# EAGLE design Logic Module - Power V7.2 (EAGLE 9.3.1)
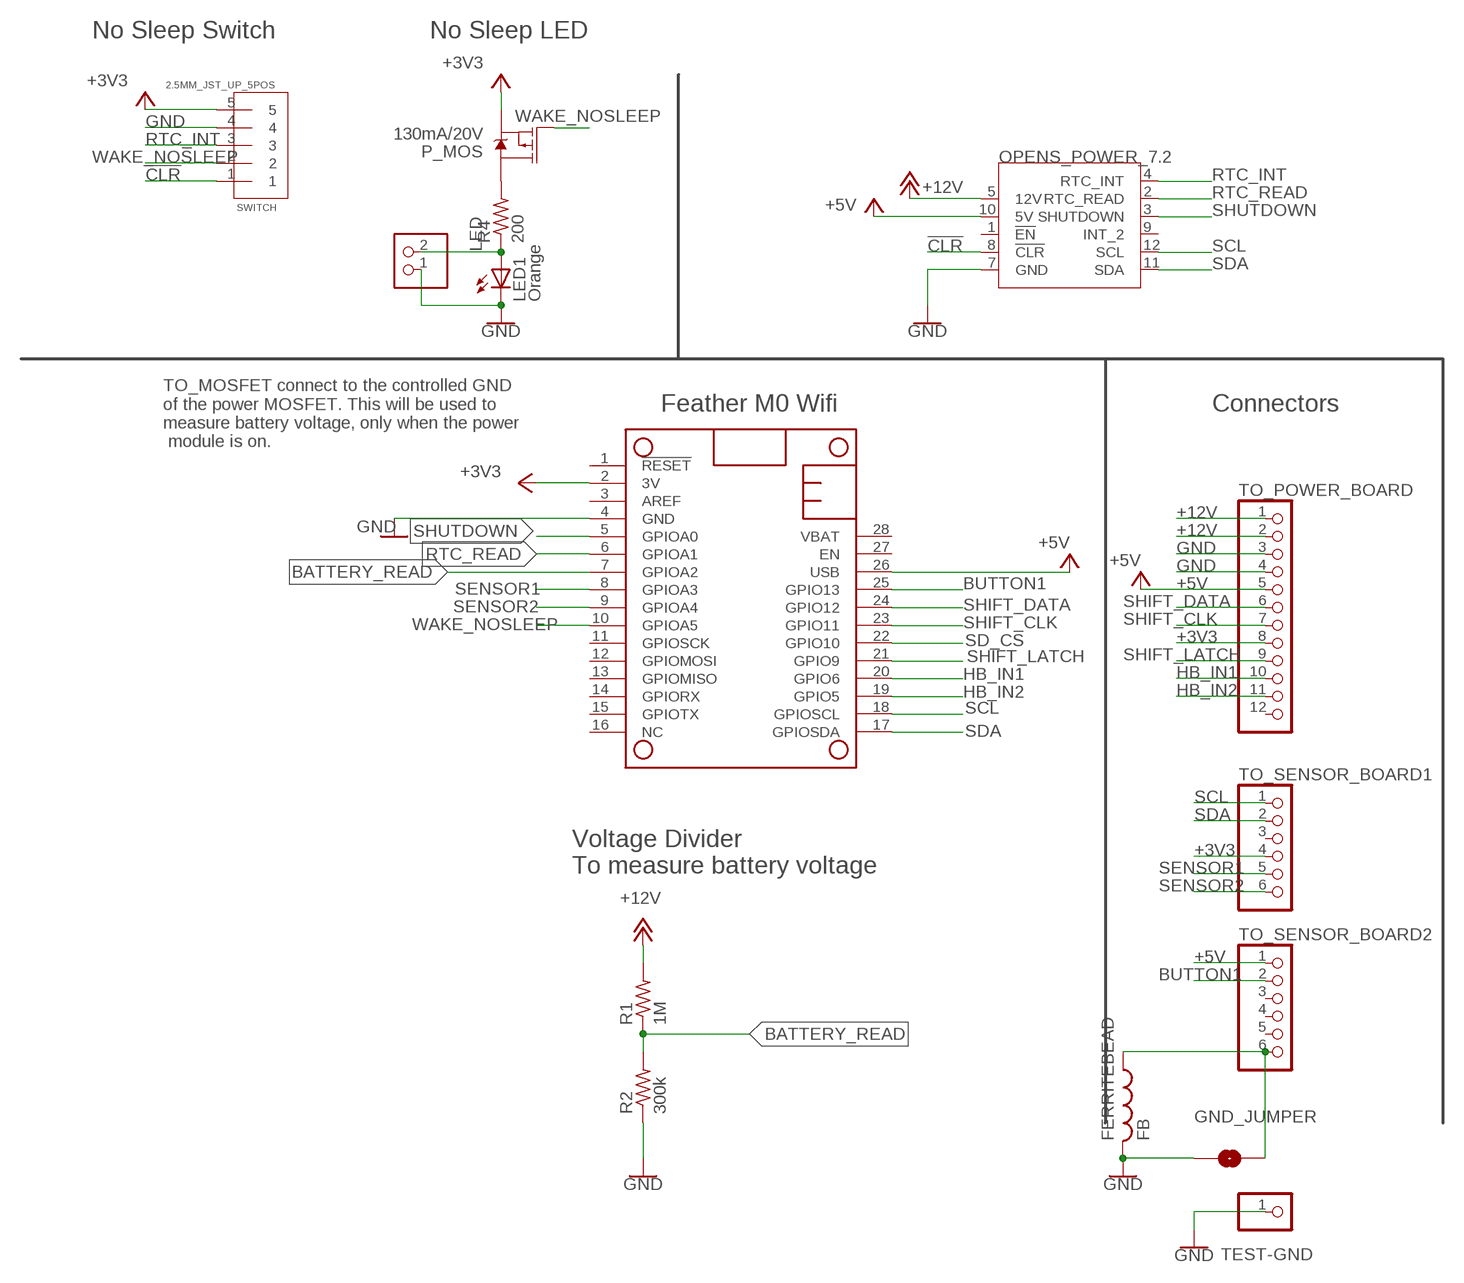
[diagram p0: schematic, sheet 1]

## Parts
FERRITEBEAD  FB  [FB]
GND_JUMPER  JUMPER-SMT_2_NO_NO-SILK  [SMT-JUMPER_2_NO_NO-SILK]
LED  2.5MM_JST_UP_2POS  [JST_2POS_2.5MM_UP]
LED1  Orange  LED3MM  [LED3MM]
MS1  FEATHERWING  [FEATHERWING]
P_MOS  130mA/20V  MOSFET_PCH-IRLML2244  [SOT23-3]
R1  1M  R-US_R1206  [R1206]
R2  300k  R-US_R1206  [R1206]
R4  200  R-US_0204/7  [0204/7]
SWITCH  2.5MM_JST_UP_5POS  [JST_5POS_2.5MM_UP]
TEST-GND  PINHD-1X1  [1X01]
TO_POWER_BOARD  PINHD-1X12  [1X12]
TO_SENSOR_BOARD1  PINHD-1X6CB  [1X06-CLEANBIG]
TO_SENSOR_BOARD2  PINHD-1X6CB  [1X06-CLEANBIG]
U$1  OPENS_POWER_7.2  [OPENS_POWER_7.2]

## Nets
!CLR: SWITCH.1 U$1.8(!CLR)
+3V3: MS1.2(3V) P_MOS.2(S) SWITCH.5 TO_POWER_BOARD.8 TO_SENSOR_BOARD1.4
+5V [12v]: MS1.26(USB) TO_POWER_BOARD.5 TO_SENSOR_BOARD2.1 U$1.10(5V)
+12V [12v]: R1.2 TO_POWER_BOARD.1 TO_POWER_BOARD.2 U$1.5(12V)
BATTERY_READ: MS1.7(GPIOA2) R1.1 R2.2
BUTTON1: MS1.25(GPIO13) TO_SENSOR_BOARD2.2
GND: FERRITEBEAD.P$2 GND_JUMPER.1 LED1.K(C) LED.1 MS1.4(GND) R2.1 SWITCH.4 TEST-GND.1 TO_POWER_BOARD.3 TO_POWER_BOARD.4 U$1.7(GND)
HB_IN1: MS1.20(GPIO6) TO_POWER_BOARD.10
HB_IN2: MS1.19(GPIO5) TO_POWER_BOARD.11
N$2: P_MOS.3(D) R4.2
N$3: LED1.A LED.2 R4.1
N$6: FERRITEBEAD.P$1 GND_JUMPER.2 TO_SENSOR_BOARD2.6
RTC_INT: SWITCH.3 U$1.4(RTC_INT)
RTC_READ: MS1.6(GPIOA1) U$1.2(RTC_READ)
SCL: MS1.18(GPIOSCL) TO_SENSOR_BOARD1.1 U$1.12(SCL)
SD_CS: MS1.22(GPIO10)
SDA: MS1.17(GPIOSDA) TO_SENSOR_BOARD1.2 U$1.11(SDA)
SENSOR1: MS1.8(GPIOA3) TO_SENSOR_BOARD1.5
SENSOR2: MS1.9(GPIOA4) TO_SENSOR_BOARD1.6
SHIFT_CLK: MS1.23(GPIO11) TO_POWER_BOARD.7
SHIFT_DATA: MS1.24(GPIO12) TO_POWER_BOARD.6
SHIFT_LATCH: MS1.21(GPIO9) TO_POWER_BOARD.9
SHUTDOWN: MS1.5(GPIOA0) U$1.3(SHUTDOWN)
WAKE_NOSLEEP: MS1.10(GPIOA5) P_MOS.1(G) SWITCH.2
Unconnected: MS1.1(!RESET) MS1.3(AREF) MS1.11(GPIOSCK) MS1.12(GPIOMOSI) MS1.13(GPIOMISO) MS1.14(GPIORX) MS1.15(GPIOTX) MS1.16(NC) MS1.27(EN) MS1.28(VBAT) TO_POWER_BOARD.12 TO_SENSOR_BOARD1.3 TO_SENSOR_BOARD2.3 TO_SENSOR_BOARD2.4 TO_SENSOR_BOARD2.5 U$1.1(!EN) U$1.9(INT_2)

## Notes on the sheet
- No Sleep Switch | No Sleep LED
- Feather M0 Wifi | Connectors
- TO_MOSFET connect to the controlled GND 
  of the power MOSFET. This will be used to
  measure battery voltage, only when the power
   module is on.
- Voltage Divider
  To measure battery voltage

## Library data of the parts
FERRITEBEAD = adafruit:FB: Ferrite bead Digikey #P9821BK-ND
GND_JUMPER = SparkFun-Jumpers:JUMPER-SMT_2_NO: Normally open jumper This jumper has two pads in close proximity to each other. Apply solder to close the connection. Round pads are easier to solder for beginners, but are a lot larger. SparkFun Product that uses the round pads: SparkFun EL Sequencer <https://www.sparkfun.com/products/12781>
LED = eDNA:2.5MM_JST_UP_2POS
LED1 = adafruit:LED: LED OSRAM: - CHIPLED LG R971, LG N971, LY N971, LG Q971, LY Q971, LO R971, LY R971 LH N974, LH R974 LS Q976, LO Q976, LY Q976 LO Q996 - Hyper CHIPLED LW Q18S LB Q993, LB Q99A, LB R99A - SideLED LS A670, LO A670, LY A670, LG A670, LP A670 LB A673, LV A673, LT A673, LW A673 LH A674 LY A675 LS A676, LA A676, LO A676, LY A676, LW A676 LS A679, LY A679, LG A679 - Hyper Micro SIDELED® LS Y876, LA Y876, LO Y876, LY Y876 LT Y87S - SmartLED LW L88C, LW L88S LB L89C, LB L89S, LG L890 LS L89K, LO L89K, LY L89K LS L896, LA L896, LO L896, LY L896 - TOPLED LS T670, LO T670, LY T670, LG T670, LP T670 LSG T670, LSP T670, LSY T670, LOP T670, LYG T670 LG T671, LOG T671, LSG T671 LB T673, LV T673, LT T673, LW T673 LH T674 LS T676, LA T676, LO T676, LY T676, LB T676, LH T676, LSB T676, LW T676 LB T67C, LV T67C, LT T67C, LS T67K, LO T67K, LY T67K, LW E67C LS E67B, LA E67B, LO E67B, LY E67B, LB E67C, LV E67C, LT E67C LW T67C LS T679, LY T679, LG T679 LS T770, LO T770, LY T770, LG T770, LP T770 LB T773, LV T773, LT T773, LW T773 LH T774 LS E675, LA E675, LY E675, LS T675 LS T776, LA T776, LO T776, LY T776, LB T776 LHGB T686 LT T68C, LB T68C - Hyper Mini TOPLED® LB M676 - Mini TOPLED Santana® LG M470 LS M47K, LO M47K, LY M47K Source: http://www.osram.convergy.de/
MS1 = adafruit:FEATHERWING
P_MOS = SparkFun-DiscreteSemi:MOSFET_PCH: P-channel MOSFETs Voltage controlled devices that allow control of high current outputs. SparkFun Products: SparkFun ESP32 Thing <https://www.sparkfun.com/products/13907> SparkFun ESP8266 Thing <https://www.sparkfun.com/products/13231>; PROD_ID: TRANS-11153; VALUE: 4.3A/20V/54mΩ
R1 R2 R4 = adafruit:R-US_: RESISTOR, American symbol
SWITCH = eDNA:2.5MM_JST_UP_5POS: 2.5MM JST 5POS, 5 Position, up https://www.digikey.com/product-detail/en/jst-sales-america-inc/B5B-XH-A-LF-SN/455-2270-ND/1530483
TEST-GND = adafruit:PINHD-1X1: Pin header 1x1 for 0.1" spacing With round pins
TO_POWER_BOARD = adafruit:PINHD-1X12: PIN HEADER
TO_SENSOR_BOARD1 TO_SENSOR_BOARD2 = adafruit:PINHD-1X6: PIN HEADER
U$1 = eDNA:OPENS_POWER_7.2: OPENSLAB power board version 7.2 Designed by Mitch and upgrade/update by Bao Nguyen

## Net classes
0 default: clearance 0.2 mm
1 12v: width 0.61 mm, clearance 0.356 mm
2 5v: width 0.406 mm, clearance 0.305 mm
3 sig: width 0.152 mm, clearance 0.152 mm

## Board
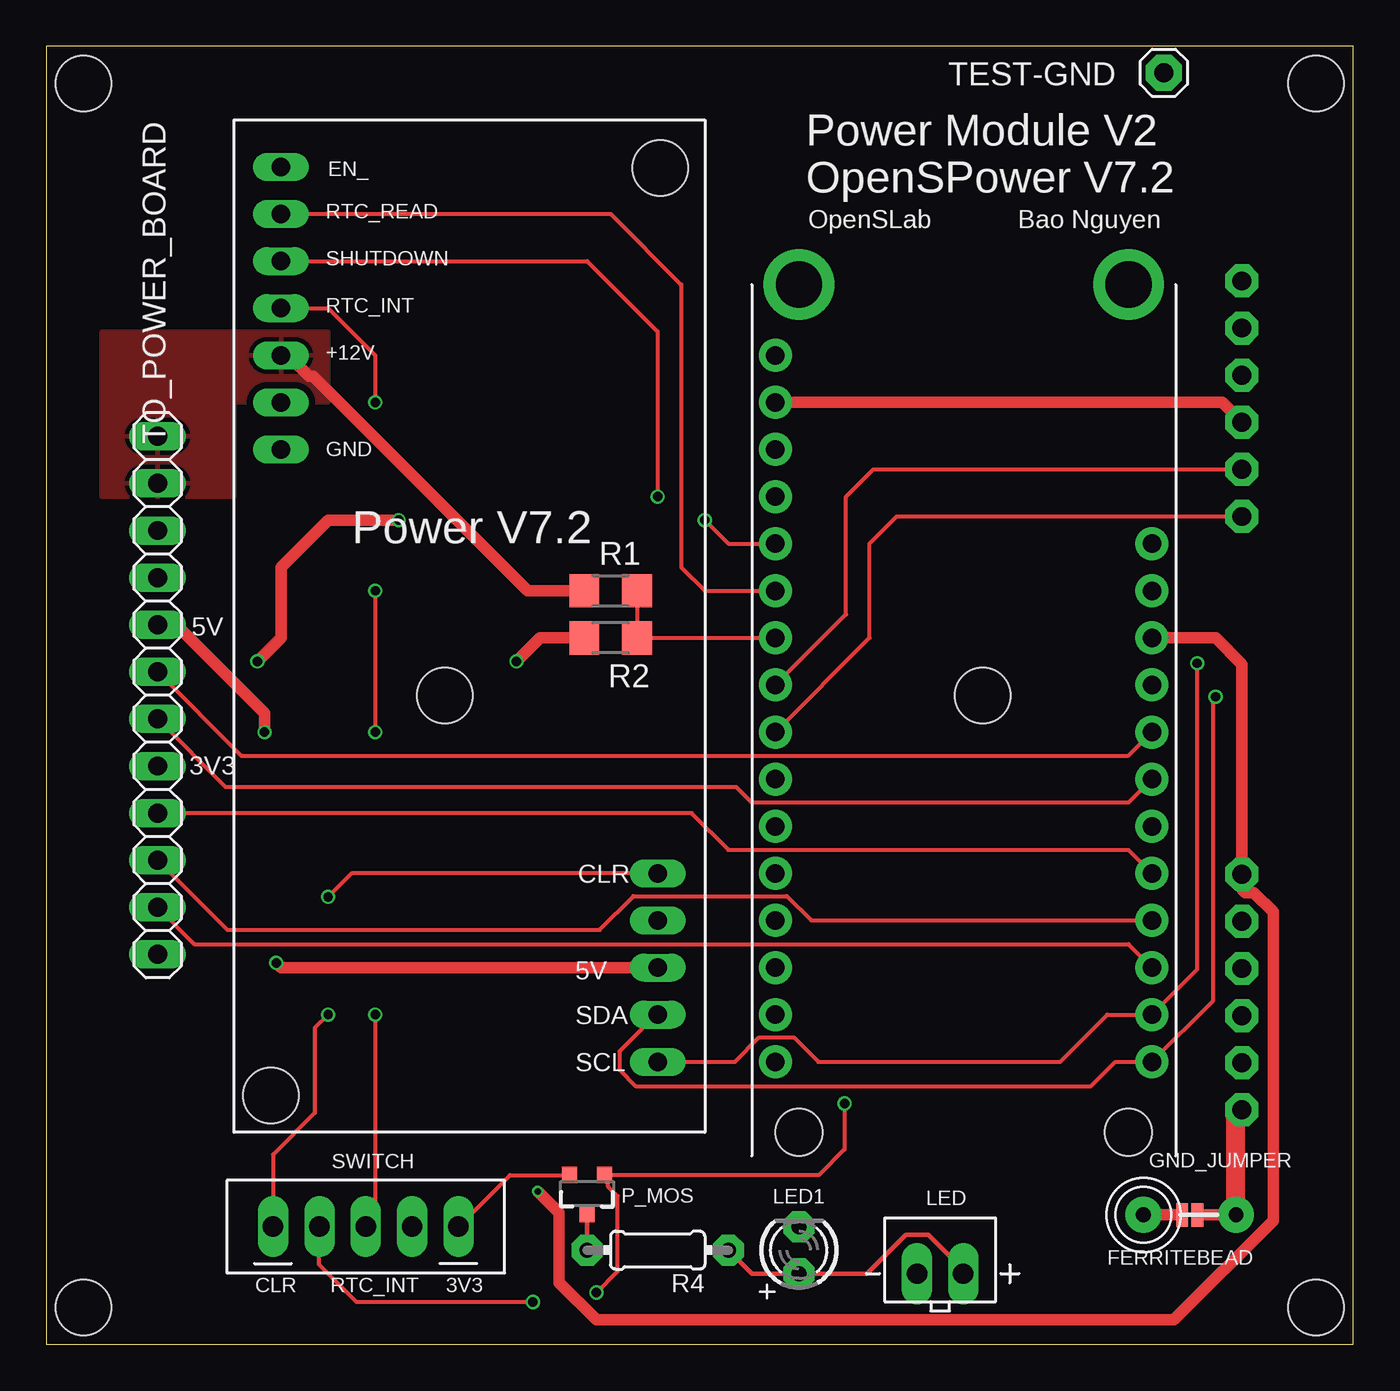
[diagram p1: board, top side]
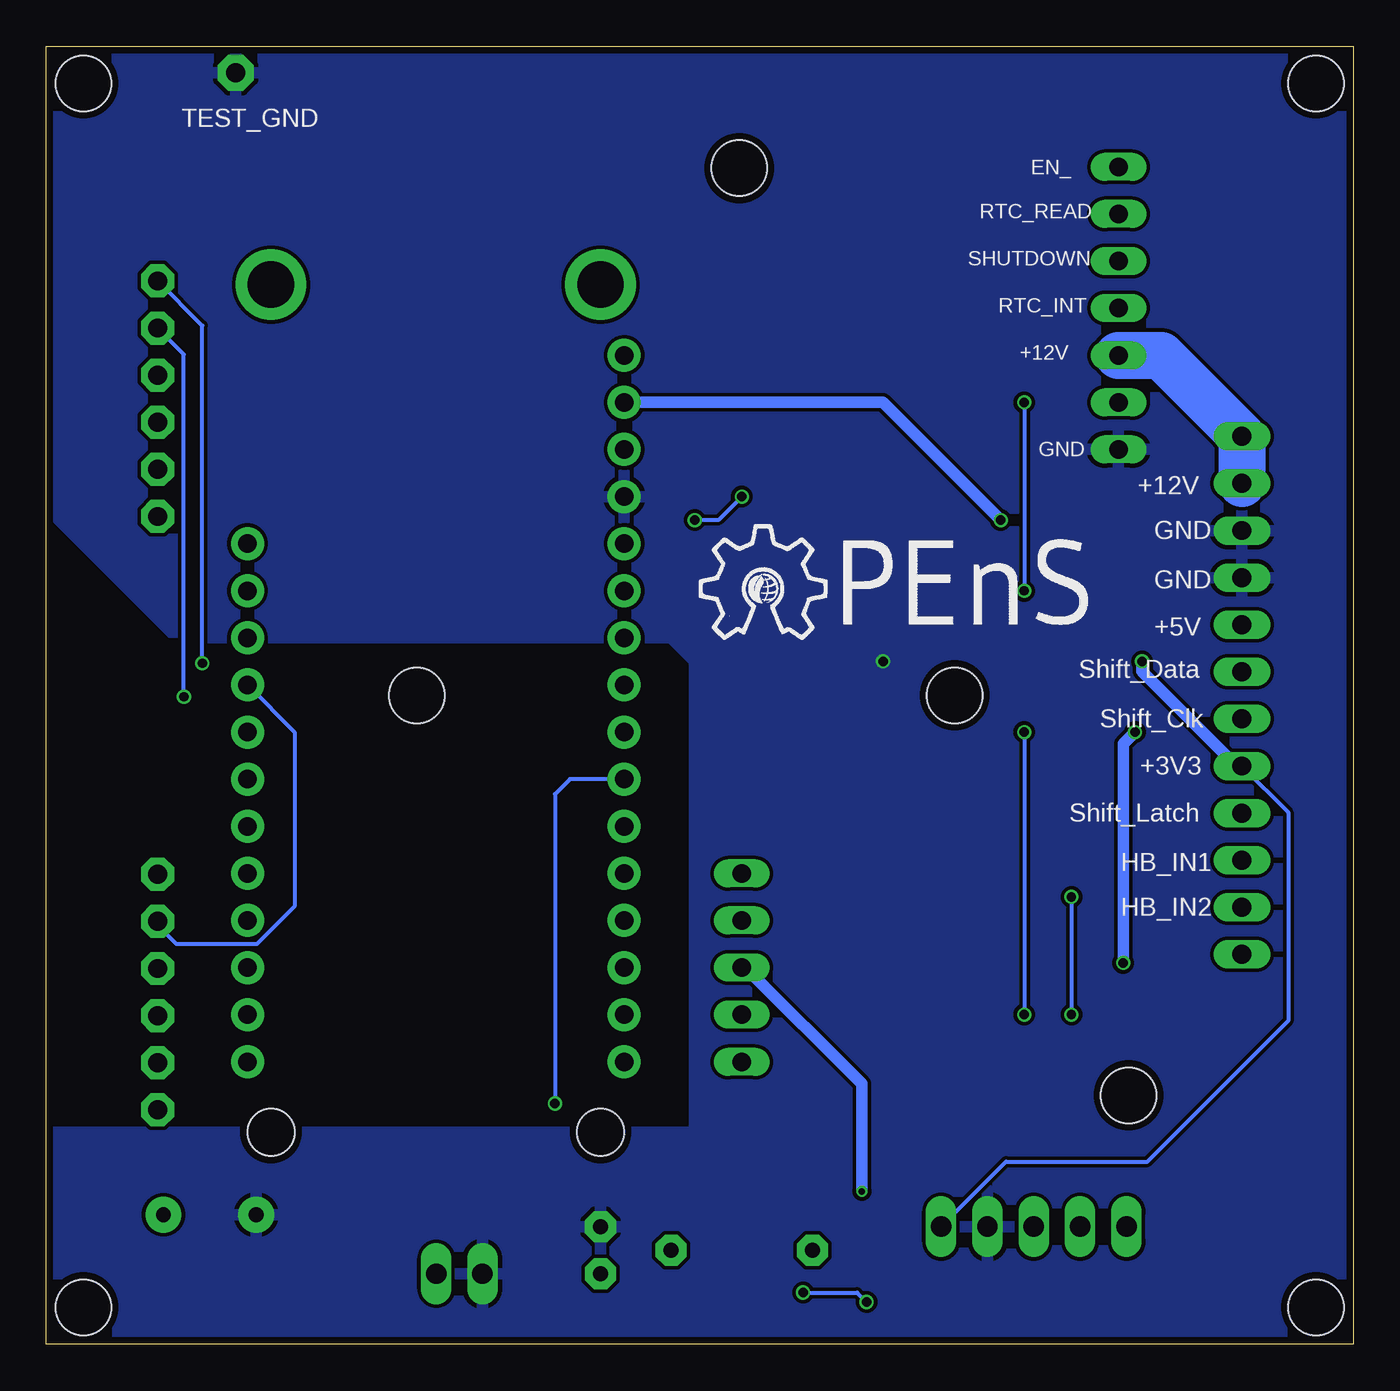
[diagram p2: board, bottom side, seen from below]

Size 70.5 x 70 mm. Coordinates in mm from the lower left corner, seen from the top.
Outline: 0,0 70.5,0 70.5,70 0,70 0,0
Copper layers (1*16): Top 0.035559375mm / dielectric 1.6mm / Bottom 0.035559375mm
Design rules "oshpark-2layer": minimum track width 6mil, minimum drill 10mil, track to track 6mil, track to pad 6mil, pad to pad 6mil, via to via 6mil, smd to smd 6mil, copper to edge 15mil, drill to drill 6mil, minimum pad ring 5mil, minimum via ring 5mil, stop-mask expansion 2.5mil, vias tented up to drill 0mil, thermal gap 10mil
Holes 3 mm at 2,2 2,68 68.5,68 68.5,2 21.5,35 50.5,35

### Footprints (pad centres in the part's own frame; a part is rotated, then mirrored left to right if it is on the bottom)
FB = drill 0.8 pad 1.93: P$1 -2.5,0; P$2 2.5,0
SMT-JUMPER_2_NO_NO-SILK = smd 0.635 x 1.27: 1 -0.406,0; 2 0.406,0
JST_2POS_2.5MM_UP = drill 1.1 long: 1 -1.25,0; 2 1.25,0
LED3MM = drill 0.813 pad 1.676 octagon: A -1.27,0; K 1.27,0
FEATHERWING = drill 1 pad 1.778: 1 6.35,1.27; 2 8.89,1.27; 3 11.43,1.27; 4 13.97,1.27; 5 16.51,1.27; 6 19.05,1.27; 7 21.59,1.27; 8 24.13,1.27; 9 26.67,1.27; 10 29.21,1.27; 11 31.75,1.27; 12 34.29,1.27; 13 36.83,1.27; 14 39.37,1.27; 15 41.91,1.27; 16 44.45,1.27; 17 44.45,21.59; 18 41.91,21.59; 19 39.37,21.59; 20 36.83,21.59; 21 34.29,21.59; 22 31.75,21.59; 23 29.21,21.59; 24 26.67,21.59; 25 24.13,21.59; 26 21.59,21.59; 27 19.05,21.59; 28 16.51,21.59 | drill 2.5 pad 3.81: P$1 2.54,20.32; P$2 2.54,2.54 | hole 2.54: 48.26,20.32; 48.26,2.54
SOT23-3 = smd 0.8 x 0.9: 1 -0.95,-1; 2 0.95,-1; 3 0,1.1
R1206 = smd 1.6 x 1.803: 1 -1.422,0; 2 1.422,0
0204/7 = drill 0.813 pad 1.676 octagon: 1 -3.81,0; 2 3.81,0
JST_5POS_2.5MM_UP = drill 1.1 long: 1 -5,0; 2 -2.5,0; 3 0,0; 4 2.5,0; 5 5,0
1X01 = drill 1.016 pad 1.93 octagon: 1 0,0
1X12 = drill 1.016 long: 1 -13.97,0; 2 -11.43,0; 3 -8.89,0; 4 -6.35,0; 5 -3.81,0; 6 -1.27,0; 7 1.27,0; 8 3.81,0; 9 6.35,0; 10 8.89,0; 11 11.43,0; 12 13.97,0
1X06-CLEANBIG = drill 1.016 pad 1.778 octagon: 1 -6.35,0; 2 -3.81,0; 3 -1.27,0; 4 1.27,0; 5 3.81,0; 6 6.35,0
OPENS_POWER_7.2 = drill 1 pad 1.422 long: 1 2.54,52.07; 2 2.54,49.53; 3 2.54,46.99; 4 2.54,44.45; 5 2.54,41.91; 6 2.54,39.37; 7 2.54,36.83; 8 22.86,13.97; 9 22.86,11.43; 10 22.86,8.89; 11 22.86,6.35; 12 22.86,3.81 | hole 3: 2,2; 23,52

### Placement (x,y rotation side)
FERRITEBEAD  61.68,6.99 180 top
GND_JUMPER  61.68,6.99 0 top
LED  48.22,3.81 0 top
LED1  40.6,5.08 90 top
MS1  38.06,59.69 270 top
P_MOS  29.17,8.13 180 top
R1  30.44,40.64 180 top
R2  30.44,38.1 0 top
R4  32.98,5.08 180 top
SWITCH  17.23,6.35 0 top
TEST-GND  60.28,68.58 90 top
TO_POWER_BOARD  6,35 270 top
TO_SENSOR_BOARD1  64.5,51 270 top
TO_SENSOR_BOARD2  64.5,19 270 top
U$1  10.12,11.43 0 top
U$2  [OPENS-LOGO]  35.52,34.29 0 bottom

### Tracks (layer width: path | path; a pad name or v marks a point on that pad's centre or on a via)
!CLR  (via drill 0.51)
  Top 0.203: U$1.8 16.47,25.4 v15.2,24.13 | v15.2,17.78 14.48,17.06 14.48,12.48 12.23,10.23 SWITCH.1
  Bottom 0.203: v15.2,24.13 v15.2,17.78
+3V3  (via drill 0.51)
  Top 0.203: SWITCH.5 25.01,9.13 P_MOS.2
  Top 0.61: TO_SENSOR_BOARD1.4 63.43,50.8 MS1.2 | v11.39,36.83 12.66,38.1 12.66,41.91 15.2,44.45 v19.01,44.45
  Bottom 0.203: TO_POWER_BOARD.8 3.5,28.69 3.5,17.44 11.09,9.85 18.73,9.85 SWITCH.5
  Bottom 0.61: TO_POWER_BOARD.8 6.27,31.19 11.39,36.31 v11.39,36.83 | v19.01,44.45 25.36,50.8 MS1.2
+5V  (via drill 0.35, 0.51)
  Top 0.61: MS1.26 63.08,38.1 64.5,36.68 TO_SENSOR_BOARD2.1 64.5,24.54 64.68,24.36 65.14,24.36 66.18,23.32 66.18,6.67 60.83,1.32 29.68,1.32 27.67,3.33 27.67,7.09 v26.5,8.26 | TO_POWER_BOARD.5 7,38.81 11.77,34.03 v11.77,33.02 | v12.41,20.57 12.66,20.32 U$1.10
  Bottom 0.61: v11.77,33.02 12.41,32.38 v12.41,20.57 | U$1.10 32.77,20.32 26.5,14.05 v26.5,8.26
+12V
  Top 0.61: R1.2 25.95,40.64 14.38,52.21 14.17,52.21 13.04,53.34 U$1.5
  Bottom 2.54: U$1.5 10.37,53.34 TO_POWER_BOARD.1 TO_POWER_BOARD.2
  pour Top: 15.2,54.61 3,54.61 3,45.72 10.12,45.72 10.12,50.8 15.2,50.8
BATTERY_READ
  Top 0.203: MS1.7 R2.2 R1.1
BUTTON1
  Bottom 0.203: MS1.25 57.11,33.02 57.11,23.62 59.14,21.59 63.46,21.59 64.5,22.63 TO_SENSOR_BOARD2.2
GND  (via drill 0.51)
  Top 0.61: R2.1 26.63,38.1 v25.36,36.83 | GND_JUMPER.1 FERRITEBEAD.P$2
  pour Bottom: 0,69.85 70.27,69.85 70.27,44.91 63.46,38.1 36.79,38.1 35.52,36.83 35.52,11.43 70.27,11.43 70.27,0 0,0
HB_IN1
  Top 0.203: TO_POWER_BOARD.10 9.76,22.35 29.84,22.35 31.67,24.18 39.95,24.18 41.27,22.86 MS1.20
HB_IN2
  Top 0.203: TO_POWER_BOARD.11 7.98,21.59 58.38,21.59 MS1.19
N$2
  Top 0.254: R4.2 P_MOS.3
N$3
  Top 0.254: R4.1 38.06,3.81 LED1.A 44.26,3.81 46.37,5.91 47.57,5.91 49.47,4.02 LED.2
N$6
  Top 0.61: GND_JUMPER.2 FERRITEBEAD.P$1
  Top 1.016: FERRITEBEAD.P$1 64.18,12.33 TO_SENSOR_BOARD2.6
RTC_INT  (via drill 0.51)
  Top 0.203: U$1.4 15.2,55.88 17.74,53.34 v17.74,50.8 | v17.74,40.64 v17.74,33.02 | v17.74,17.78 17.74,6.86 SWITCH.3
  Bottom 0.203: v17.74,50.8 v17.74,40.64 | v17.74,33.02 v17.74,17.78
RTC_READ
  Top 0.203: U$1.2 30.44,60.96 34.25,57.15 34.25,41.91 35.52,40.64 MS1.6
SCL  (via drill 0.51)
  Top 0.203: U$1.12 37.14,15.24 38.46,16.56 40.33,16.56 41.65,15.24 54.7,15.24 57.24,17.78 MS1.18 62.09,20.22 v62.09,36.73
  Bottom 0.203: v62.09,36.73 62.09,54.94 TO_SENSOR_BOARD1.1
SDA  (via drill 0.51)
  Top 0.203: U$1.11 32.89,17.78 30.92,15.8 30.92,14.8 31.8,13.92 56.36,13.92 57.68,15.24 MS1.17 62.95,18.54 62.95,34.8 v63.08,34.92
  Bottom 0.203: v63.08,34.92 63.08,53.39 TO_SENSOR_BOARD1.2
SENSOR1
  Top 0.203: MS1.8 43.14,39.37 43.14,45.72 44.61,47.19 TO_SENSOR_BOARD1.5
SENSOR2
  Top 0.203: MS1.9 44.41,38.1 44.41,43.18 45.88,44.65 TO_SENSOR_BOARD1.6
SHIFT_CLK
  Top 0.203: TO_POWER_BOARD.7 9.68,30.05 37.22,30.05 38.06,29.21 58.38,29.21 MS1.23
SHIFT_DATA
  Top 0.203: MS1.24 58.38,31.75 10.52,31.75 TO_POWER_BOARD.6
SHIFT_LATCH
  Top 0.203: TO_POWER_BOARD.9 34.81,28.65 36.79,26.67 58.38,26.67 MS1.21
SHUTDOWN  (via drill 0.51)
  Top 0.203: U$1.3 29.17,58.42 32.98,54.61 v32.98,45.72 | v35.52,44.45 36.79,43.18 MS1.5
  Bottom 0.203: v32.98,45.72 34.25,44.45 v35.52,44.45
WAKE_NOSLEEP  (via drill 0.51)
  Top 0.203: v43.06,12.99 43.06,10.52 41.67,9.13 P_MOS.1 30.31,8.94 30.31,8.51 30.82,8 30.82,3.94 v29.68,2.79 | SWITCH.2 14.69,6.31 14.69,4.32 16.72,2.29 v26.25,2.29
  Bottom 0.203: MS1.10 42.25,30.48 43.06,29.67 v43.06,12.99 | v29.68,2.79 26.76,2.79 v26.25,2.29

### Text on the board
tPlace: EN_ | Power Module V2 / OpenSPower V7.2 | RTC_READ | OpenSLab | Bao Nguyen | SHUTDOWN | RTC_INT | +12V | GND | 5V | 3V3 | CLR | 5V | SDA | SCL | CLR | RTC_INT | 3V3
bPlace: TEST_GND | EN_ | RTC_READ | SHUTDOWN | RTC_INT | +12V | GND | +12V | GND | GND | +5V | Shift_Data | Shift_Clk | +3V3 | Shift_Latch | HB_IN1 | HB_IN2